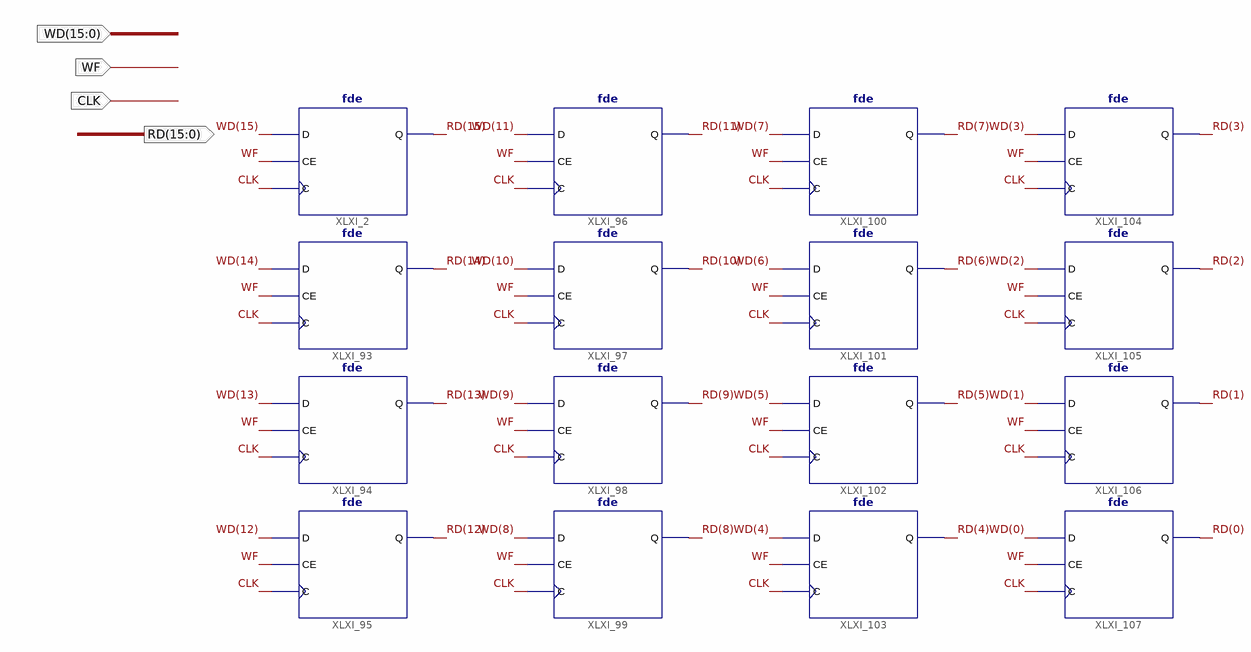
[diagram p0: schematic sheet 1]
// Xilinx ISE schematic Reg16.sch (spartan3e) as structural Verilog: 16 symbols, 4 ports
module Reg16 (
  input  [15:0] WD,
  input  WF,
  input  CLK,
  output [15:0] RD
);

  fde XLXI_2 (.C(CLK), .CE(WF), .D(WD[15]), .Q(RD[15]));
  fde XLXI_93 (.C(CLK), .CE(WF), .D(WD[14]), .Q(RD[14]));
  fde XLXI_94 (.C(CLK), .CE(WF), .D(WD[13]), .Q(RD[13]));
  fde XLXI_95 (.C(CLK), .CE(WF), .D(WD[12]), .Q(RD[12]));
  fde XLXI_96 (.C(CLK), .CE(WF), .D(WD[11]), .Q(RD[11]));
  fde XLXI_97 (.C(CLK), .CE(WF), .D(WD[10]), .Q(RD[10]));
  fde XLXI_98 (.C(CLK), .CE(WF), .D(WD[9]), .Q(RD[9]));
  fde XLXI_99 (.C(CLK), .CE(WF), .D(WD[8]), .Q(RD[8]));
  fde XLXI_100 (.C(CLK), .CE(WF), .D(WD[7]), .Q(RD[7]));
  fde XLXI_101 (.C(CLK), .CE(WF), .D(WD[6]), .Q(RD[6]));
  fde XLXI_102 (.C(CLK), .CE(WF), .D(WD[5]), .Q(RD[5]));
  fde XLXI_103 (.C(CLK), .CE(WF), .D(WD[4]), .Q(RD[4]));
  fde XLXI_104 (.C(CLK), .CE(WF), .D(WD[3]), .Q(RD[3]));
  fde XLXI_105 (.C(CLK), .CE(WF), .D(WD[2]), .Q(RD[2]));
  fde XLXI_106 (.C(CLK), .CE(WF), .D(WD[1]), .Q(RD[1]));
  fde XLXI_107 (.C(CLK), .CE(WF), .D(WD[0]), .Q(RD[0]));
endmodule
